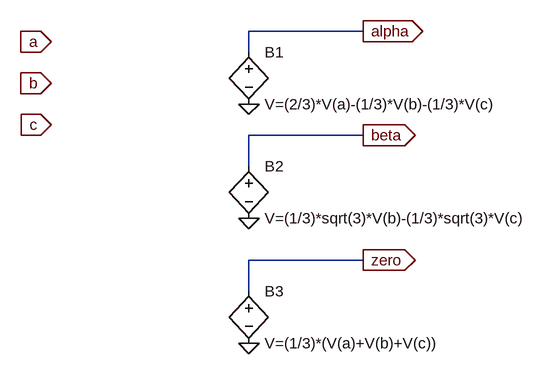
[diagram p0: schematic clarke.asc]
clarke.asc, the LTspice schematic file:
Version 4
SHEET 1 880 680
WIRE 512 112 336 112
WIRE 336 144 336 112
WIRE 512 272 336 272
WIRE 336 320 336 272
WIRE 512 464 336 464
WIRE 336 512 336 464
FLAG 32 128 a
IOPIN 32 128 In
FLAG 32 192 b
IOPIN 32 192 In
FLAG 32 256 c
IOPIN 32 256 In
FLAG 336 224 0
FLAG 336 400 0
FLAG 512 112 alpha
IOPIN 512 112 Out
FLAG 512 272 beta
IOPIN 512 272 Out
FLAG 336 592 0
FLAG 512 464 zero
IOPIN 512 464 Out
SYMBOL bv 336 128 R0
SYMATTR InstName B1
SYMATTR Value V=(2/3)*V(a)-(1/3)*V(b)-(1/3)*V(c)
SYMBOL bv 336 304 R0
SYMATTR InstName B2
SYMATTR Value V=(1/3)*sqrt(3)*V(b)-(1/3)*sqrt(3)*V(c)
SYMBOL bv 336 496 R0
SYMATTR InstName B3
SYMATTR Value V=(1/3)*(V(a)+V(b)+V(c))

The netlist it stands for:
* clarke.asc
B1 alpha 0 V=(2/3)*V(a)-(1/3)*V(b)-(1/3)*V(c)
B2 beta 0 V=(1/3)*sqrt(3)*V(b)-(1/3)*sqrt(3)*V(c)
B3 zero 0 V=(1/3)*(V(a)+V(b)+V(c))
.backanno
.end